# EAGLE design I2C-8574-cTc (EAGLE 7.7.0)
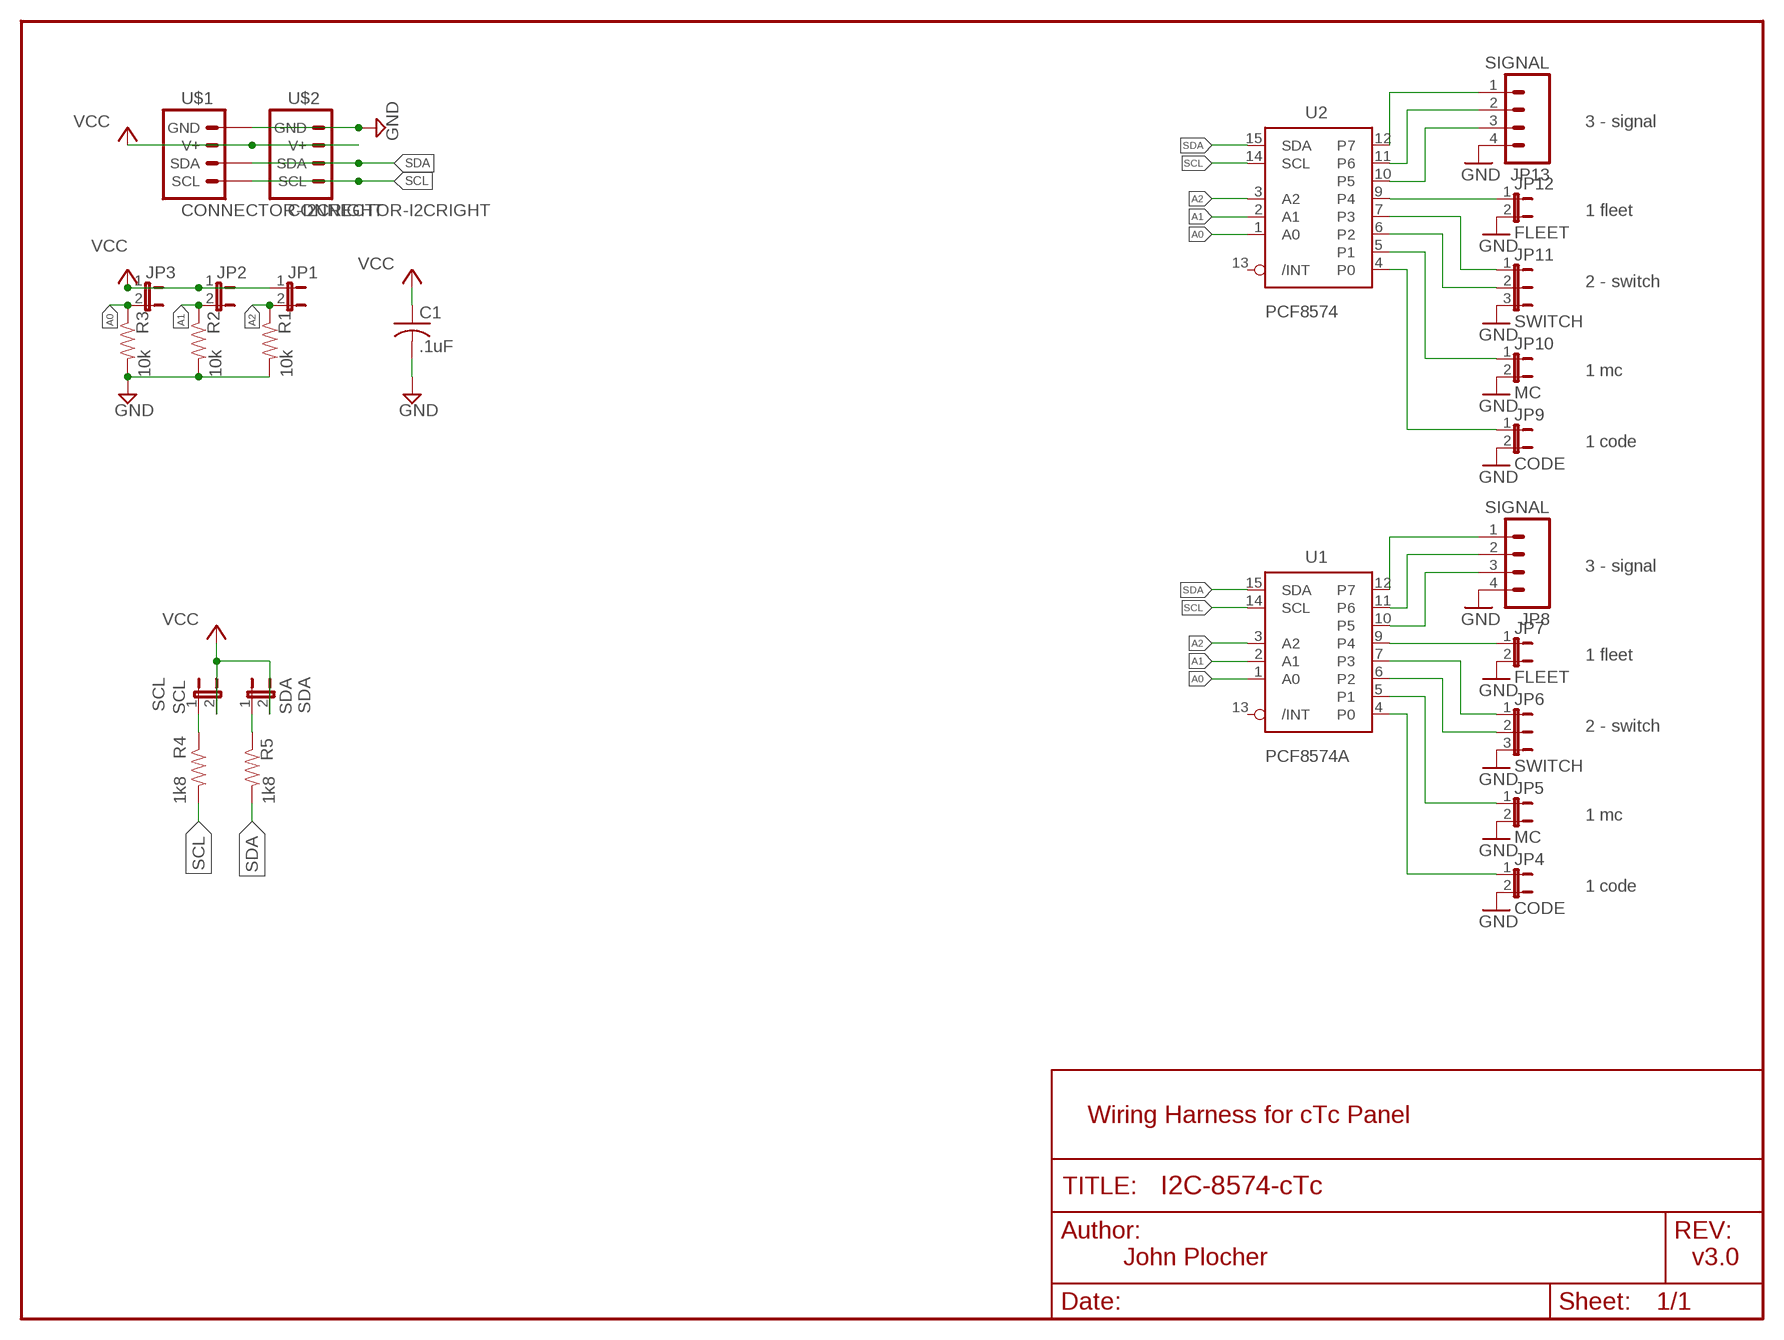
[diagram p0: schematic, sheet 1]

## Parts
C1  .1uF  CAP0805  [0805-CAP]
JP1  JUMPER-2SMD-NO  [SJ_2S-NO]
JP2  JUMPER-2SMD-NO  [SJ_2S-NO]
JP3  JUMPER-2SMD-NO  [SJ_2S-NO]
JP4  CODE  JUMPER-2PTH_LOCK  [1X02_LOCK]
JP5  MC  JUMPER-2PTH_LOCK  [1X02_LOCK]
JP6  SWITCH  JUMPER-3PTH-LOCK  [1X03]
JP7  FLEET  JUMPER-2PTH_LOCK  [1X02_LOCK]
JP8  SIGNAL  CONNECTOR-M04LOCK  [1X04_LOCK]
JP9  CODE  JUMPER-2PTH_LOCK  [1X02_LOCK]
JP10  MC  JUMPER-2PTH_LOCK  [1X02_LOCK]
JP11  SWITCH  JUMPER-3PTH-LOCK  [1X03]
JP12  FLEET  JUMPER-2PTH_LOCK  [1X02_LOCK]
JP13  SIGNAL  CONNECTOR-M04LOCK  [1X04_LOCK]
R1  10k  R0805-RES  [0805-RES]
R2  10k  R0805-RES  [0805-RES]
R3  10k  R0805-RES  [0805-RES]
R4  1k8  R0805-RES  [0805-RES]
R5  1k8  R0805-RES  [0805-RES]
SCL  SCL  JUMPER-2PTH_LOCK  [1X02_LOCK]
SDA  SDA  JUMPER-2PTH_LOCK  [1X02_LOCK]
U1  PCF8574A  PCF8574ADW  [SO-16DW]
U2  PCF8574  PCF8574DW  [SO-16DW]
U$1  CONNECTOR-I2CRIGHT  [I2C-R]
U$2  CONNECTOR-I2CRIGHT  [I2C-R]

## Nets
A0 [signals]: JP3.2 R3.1 U1.1(A0) U2.1(A0)
A1 [signals]: JP2.2 R2.1 U1.2(A1) U2.2(A1)
A2 [signals]: JP1.2 R1.1 U1.3(A2) U2.3(A2)
CODE0: JP4.1 U1.4(P0)
CODE1: JP9.1 U2.4(P0)
FLEET0: JP7.1 U1.9(P4)
FLEET1: JP12.1 U2.9(P4)
GND: C1.2 JP4.2 JP5.2 JP6.3 JP7.2 JP8.4 JP9.2 JP10.2 JP11.3 JP12.2 JP13.4 R1.2 R2.2 R3.2 U$1.GND U$1.GND@1(GND) U$2.GND U$2.GND@1(GND)
LEFT0: JP8.3 U1.10(P5)
LEFT1: JP13.3 U2.10(P5)
MC0: JP5.1 U1.5(P1)
MC1: JP10.1 U2.5(P1)
N0: JP6.2 U1.6(P2)
N1: JP11.2 U2.6(P2)
N$19 [signals]: R5.1 SDA.1
N$20 [signals]: R4.1 SCL.1
R0: JP6.1 U1.7(P3)
R1: JP11.1 U2.7(P3)
RIGHT0: JP8.1 U1.12(P7)
RIGHT1: JP13.1 U2.12(P7)
SCL [signals]: R4.2 U1.14(SCL) U2.14(SCL) U$1.SCL U$1.SCL@1(SCL) U$2.SCL U$2.SCL@1(SCL)
SDA [signals]: R5.2 U1.15(SDA) U2.15(SDA) U$1.SDA U$1.SDA@1(SDA) U$2.SDA U$2.SDA@1(SDA)
STOP0: JP8.2 U1.11(P6)
STOP1: JP13.2 U2.11(P6)
VCC [Power]: C1.1 JP1.1 JP2.1 JP3.1 SCL.2 SDA.2 U$1.V+ U$1.V+@1(V+) U$2.V+ U$2.V+@1(V+)
Unconnected: U1.13(/INT) U2.13(/INT)

## Notes on the sheet
- 3 - signal
- 1 fleet
- 2 - switch
- 1 mc
- 1 code
- 3 - signal
- 1 fleet
- 2 - switch
- 1 mc
- 1 code
- Wiring Harness for cTc Panel
- John Plocher | v3.0

## Power pins joined to a net without a drawn wire
GND: U1.8(GND) U2.8(GND)
VCC: U1.16(VCC) U2.16(VCC)

## Library data of the parts
C1 = SPCoast:CAP*
JP1-JP5 JP7 JP9 JP10 JP12 SCL SDA = SPCoast:JUMPER-2: Jumper Basic 0.1" spaced jumper. Use with breakaway headers.
JP6 JP11 = SPCoast:JUMPER-3
JP8 JP13 = SPCoast:CONNECTOR-M04: Header 4 Standard 4-pin 0.1" header. Use with straight break away headers (SKU : PRT-00116), right angle break away headers (PRT-00553), swiss pins (PRT-00743), machine pins (PRT-00117), and female headers (PRT-00115). Molex polarized connector foot print use with SKU : PRT-08231 with associated crimp pins and housings. 1MM SMD Version SKU: PRT-10208
R1-R5 = SPCoast:R*: Resistor Basic schematic elements and footprints for 0603, 1206, and PTH 1/10th watt (small) resistors.
U1 U2 = SPCoast:PCF8574: Remote 8-Bit I/O Expander for I²C Bus
U$1 U$2 = SPCoast:CONNECTOR-I2C

## Net classes
0 default: width 0.305 mm
1 Power: width 0.406 mm, drill 0.6 mm
2 signals: width 0.254 mm, drill 0.5 mm

## Board
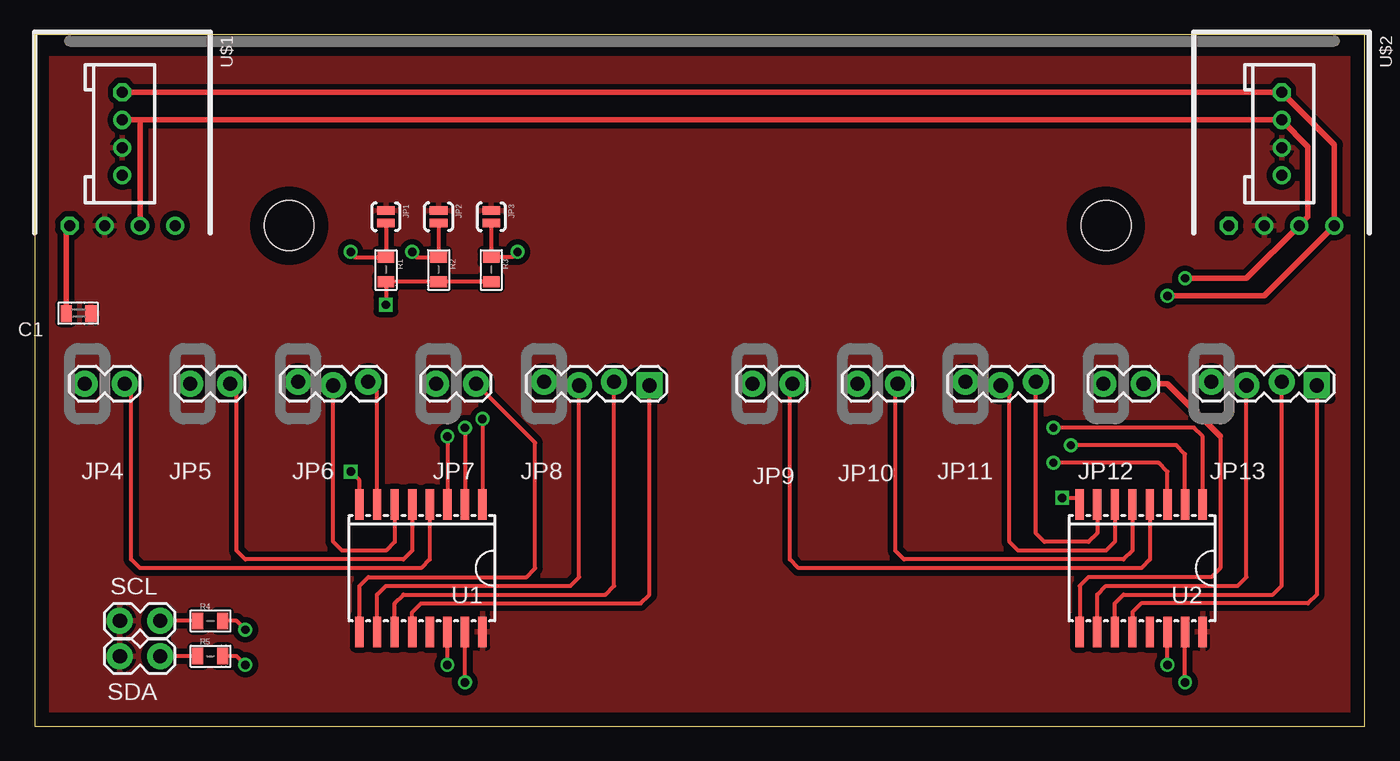
[diagram p1: board, top side]
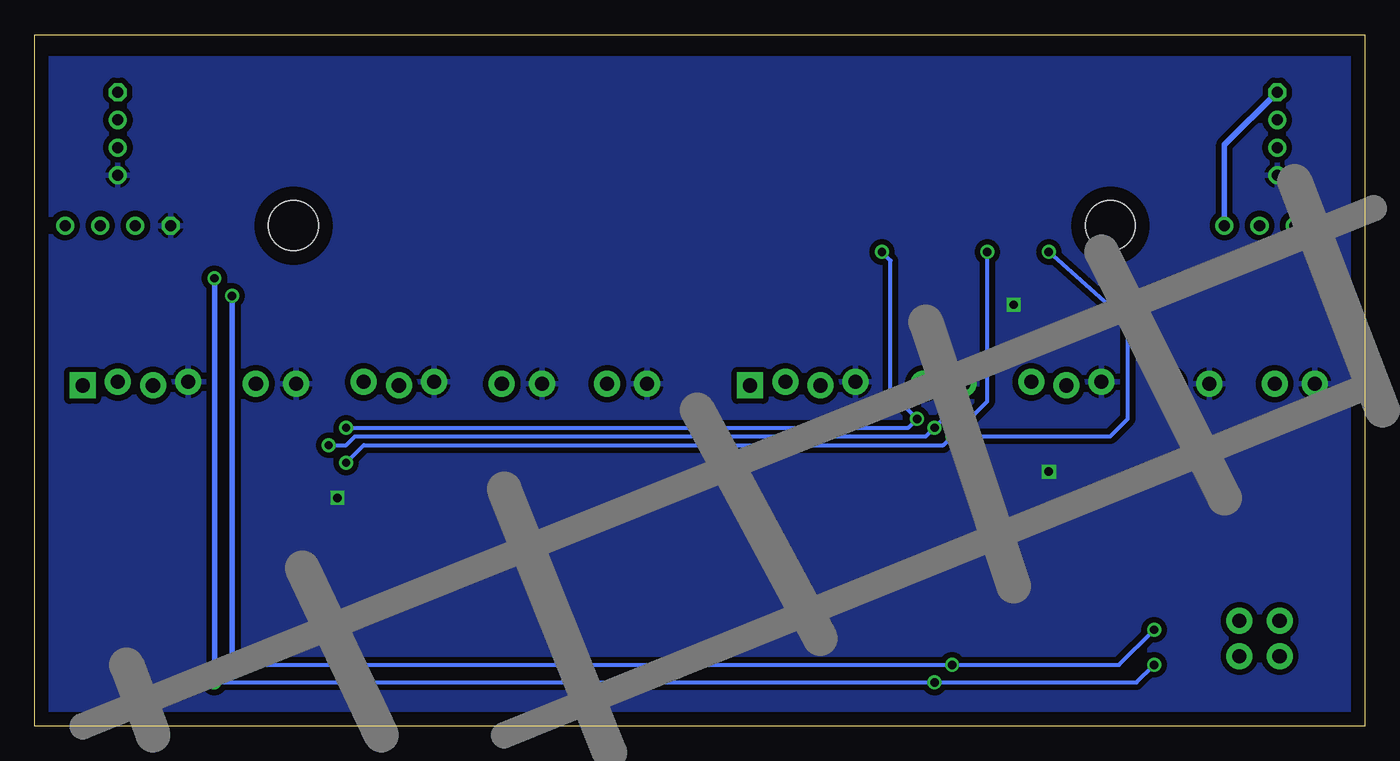
[diagram p2: board, bottom side, seen from below]

Size 96.19 x 50 mm. Coordinates in mm from the lower left corner, seen from the top.
Outline: 0,0 96.19,0 96.19,50 0,50 0,0
Copper layers (1*16): Top 0.035mm / dielectric 1.5mm / Bottom 0.035mm
Design rules "default": minimum track width 10mil, minimum drill 0.6mm, track to track 8mil, track to pad 8mil, pad to pad 8mil, via to via 8mil, smd to smd 8mil, copper to edge 40mil, drill to drill 8mil, minimum pad ring 10mil, minimum via ring 8mil, stop-mask expansion 4mil, vias tented up to drill 0mil, thermal gap 10mil
Holes 3.6 mm at 77.47,36.2 18.41,36.2

### Footprints (pad centres in the part's own frame; a part is rotated, then mirrored left to right if it is on the bottom)
0805-CAP = smd 0.8 x 1.2: 1 -0.9,0; 2 0.9,0
SJ_2S-NO = smd 0.635 x 1.27: 1 -0.45,0; 2 0.45,0
1X02_LOCK = drill 1.016 pad 1.88: 1 -0.178,0; 2 2.718,0
1X03 = drill 1.016 pad 1.88: 1 0,-0.127; 2 2.54,0.127; 3 5.08,-0.127
1X04_LOCK = drill 1.016 pad 1.88 square: 1 0,0.127 | drill 1.016 pad 1.88: 2 2.54,-0.127; 3 5.08,0.127; 4 7.62,-0.127
0805-RES = smd 0.8 x 1.2: 1 -0.9,0; 2 0.9,0
SO-16DW = smd 0.6 x 2.2: 1 -4.445,-4.6; 2 -3.175,-4.6; 3 -1.905,-4.6; 4 -0.635,-4.6; 5 0.635,-4.6; 6 1.905,-4.6; 7 3.175,-4.6; 8 4.445,-4.6; 9 4.445,4.6; 10 3.175,4.6; 11 1.905,4.6; 12 0.635,4.6; 13 -0.635,4.6; 14 -1.905,4.6; 15 -3.175,4.6; 16 -4.445,4.6
I2C-R = drill 0.8 octagon: GND 3.81,0 | drill 0.8 pad 1.27: GND@1 0,-3.635; SDA@1 0,-7.635; V+@1 0,-5.635 | drill 0.8: SCL -3.81,0; SDA -1.27,0; V+ 1.27,0 | drill 0.8 pad 1.27 octagon: SCL@1 0,-9.635

### Placement (x,y rotation side)
C1  3.17,29.84 180 top
JP1  25.4,36.83 270 top
JP2  29.21,36.83 270 top
JP3  33.02,36.83 270 top
JP4  6.35,24.77 180 top
JP5  13.97,24.77 180 top
JP6  24.13,24.77 180 top
JP7  31.75,24.77 180 top
JP8  44.45,24.77 180 top
JP9  54.61,24.77 180 top
JP10  62.23,24.77 180 top
JP11  72.39,24.77 180 top
JP12  80.01,24.77 180 top
JP13  92.71,24.77 180 top
R1  25.4,33.02 270 top
R2  29.21,33.02 270 top
R3  33.02,33.02 270 top
R4  12.7,7.62 0 top
R5  12.7,5.08 0 top
SCL  8.89,7.62 180 top
SDA  8.89,5.08 180 top
U1  27.94,11.43 180 top
U2  80.01,11.43 180 top
U$1  6.35,36.2 180 top
U$2  90.17,36.2 180 top

### Tracks (layer width: path | path; a pad name or v marks a point on that pad's centre or on a via)
A0  (via drill 0.6)
  Top 0.305: 84.45,16.51 84.45,20.95 83.82,21.59 v73.66,21.59 | v32.38,22.23 U1.1 | JP3.2 R3.1 34.55,33.92 v34.92,34.29
  Top 0.406: U2.1 84.45,16.51
  Bottom 0.305: v73.66,21.59 33.02,21.59 v32.38,22.23 34.29,24.13 34.29,33.66 v34.92,34.29
A1  (via drill 0.6)
  Top 0.305: U2.2 83.19,19.68 82.55,20.32 v74.93,20.32 | v31.11,21.59 U1.2 | JP2.2 R2.1 27.57,33.92 v27.3,34.29
  Bottom 0.305: v74.93,20.32 73.66,20.32 73.03,20.95 31.75,20.95 v31.11,21.59 30.48,22.23 28.57,22.23 27.3,23.5 v27.3,34.29
A2  (via drill 0.6)
  Top 0.305: U2.3 81.92,18.41 81.28,19.05 v73.66,19.05 | v29.84,20.95 U1.3 | JP1.2 R1.1 23.12,33.92 v22.86,34.29
  Bottom 0.305: v73.66,19.05 72.39,20.32 30.48,20.32 v29.84,20.95 18.41,20.95 17.14,22.23 17.14,29.21 v22.86,34.29
CODE0
  Top 0.305: U1.4 28.57,12.06 27.94,11.43 7.62,11.43 6.99,12.06 6.99,24.31 JP4.1
CODE1
  Top 0.305: U2.4 80.64,12.06 80.01,11.43 55.24,11.43 54.61,12.06 54.61,24.59 JP9.1
FLEET0
  Top 0.305: U1.9 23.5,10.16 24.13,10.79 35.56,10.79 36.2,11.43 36.2,20.5 JP7.1
FLEET1
  Top 0.305: 85.72,20.95 85.72,11.43 85.09,10.79 76.2,10.79 75.56,10.16 U2.9
  Top 0.406: 85.72,20.95 81.92,24.77 JP12.1
GND  (via drill 0.6)
  Top 0.305: v74.3,16.51 75.56,16.51 U2.8 | U1.8 23.5,17.78 v22.86,18.41 | R3.2 R2.2 R1.2 v25.4,30.48
  Top 0.406: C1.2 2.27,35.93 U$1.GND
  pour Bottom (isolate 0.406): 0,48.26 99.69,48.26 99.69,0 0,0
LEFT0
  Top 0.305: U1.10 24.77,9.53 25.4,10.16 38.73,10.16 39.37,10.79 JP8.3
LEFT1
  Top 0.305: U2.10 76.83,9.53 77.47,10.16 87,10.16 87.63,10.79 JP13.3
MC0
  Top 0.305: U1.5 27.3,12.7 26.67,12.06 15.24,12.06 14.61,12.7 14.61,24.31 JP5.1
MC1
  Top 0.305: U2.5 79.38,12.7 78.74,12.06 62.87,12.06 62.23,12.7 62.23,24.77 JP10.1
N0
  Top 0.305: U1.6 26.04,13.34 25.4,12.7 22.23,12.7 21.59,13.34 JP6.2
N1
  Top 0.305: U2.6 78.11,13.34 77.47,12.7 71.12,12.7 70.48,13.34 70.48,24 JP11.2
N$19
  Top 0.305: R5.1 SDA.1
N$20
  Top 0.305: R4.1 SCL.1
R0
  Top 0.305: U1.7 24.77,24.26 JP6.1
R1
  Top 0.305: U2.7 76.83,13.97 76.2,13.34 73.03,13.34 72.39,13.97 JP11.1
RIGHT0
  Top 0.305: U1.12 27.3,8.26 27.94,8.89 43.81,8.89 44.45,9.53 JP8.1
RIGHT1
  Top 0.305: JP13.1 92.71,9.53 92.08,8.89 80.01,8.89 79.38,8.26 U2.12
SCL  (via drill 0.6)
  Top 0.305: v81.92,4.45 U2.14 | v29.84,4.45 U1.14 | v15.24,6.99 14.61,7.62 R4.2
  Top 0.406: v81.92,31.11 88.9,31.11 U$2.SCL 93.98,42.02 U$2.SCL@1 U$1.SCL@1
  Bottom 0.305: v81.92,4.45 v29.84,4.45 17.78,4.45 v15.24,6.99
  Bottom 0.406: v81.92,31.11 v81.92,4.45 | U$1.SCL 10.16,42.02 U$1.SCL@1
SDA  (via drill 0.6)
  Top 0.305: v83.19,3.17 U2.15 | v31.11,3.17 U1.15 | v15.24,4.45 14.61,5.08 R5.2
  Top 0.406: v83.19,32.38 87.63,32.38 U$2.SDA 92.08,36.83 92.08,41.91 90.17,43.81 U$2.SDA@1 7.62,43.83 | U$1.SDA@1 7.62,43.83 | U$1.SDA 7.62,43.83
  Bottom 0.305: v83.19,3.17 v31.11,3.17 16.51,3.17 v15.24,4.45
  Bottom 0.406: v83.19,32.38 v83.19,3.17
STOP0
  Top 0.305: U1.11 26.04,8.89 26.67,9.53 41.27,9.53 41.91,10.16 JP8.2
STOP1
  Top 0.305: U2.11 78.11,8.89 78.74,9.53 89.53,9.53 90.17,10.16 JP13.2
VCC
  pour Top (isolate 0.406): 0,48.26 97.16,48.26 97.16,0 0,0

### Text on the board
tDocu: cTc Harness | v3.0 | A2 A1 A0 | 1 | C | M | N | R | F | L | S | R | C | M | N | R | F | L | S | R | A | John Plocher | 2015.03
bDocu: Made in the Coast Division, PCR, NMRA | I2C cTc Harness | Model Railroading is Fun!